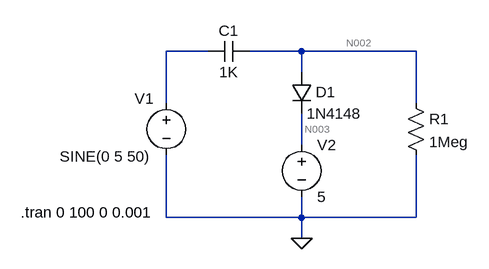
[diagram p0: schematic exercise2_transient_2.asc]
exercise2_transient_2.asc, the LTspice schematic file:
Version 4
SHEET 1 880 680
WIRE 160 -16 96 -16
WIRE 304 -16 224 -16
WIRE 480 -16 304 -16
WIRE 304 16 304 -16
WIRE 96 64 96 -16
WIRE 480 64 480 -16
WIRE 304 128 304 80
WIRE 96 240 96 144
WIRE 304 240 304 208
WIRE 304 240 96 240
WIRE 480 240 480 144
WIRE 480 240 304 240
WIRE 304 272 304 240
FLAG 304 272 0
SYMBOL diode 288 16 R0
WINDOW 0 38 31 Left 2
SYMATTR InstName D1
SYMATTR Value 1N4148
SYMBOL cap 224 -32 R90
WINDOW 0 0 32 VBottom 2
WINDOW 3 32 32 VTop 2
SYMATTR InstName C1
SYMATTR Value 1K
SYMBOL voltage 96 48 R0
WINDOW 0 -49 9 Left 2
WINDOW 3 -164 98 Left 2
WINDOW 123 0 0 Left 0
WINDOW 39 0 0 Left 0
SYMATTR InstName V1
SYMATTR Value SINE(0 5 50)
SYMBOL res 464 48 R0
SYMATTR InstName R1
SYMATTR Value 1Meg
SYMBOL voltage 304 112 R0
WINDOW 123 0 0 Left 0
WINDOW 39 0 0 Left 0
SYMATTR InstName V2
SYMATTR Value 5
TEXT -128 232 Left 2 !.tran 0 100 0 0.001

The netlist it stands for:
* exercise2_transient_2.asc
D1 N002 N003 1N4148
C1 N002 N001 1K
V1 N001 0 SINE(0 5 50)
R1 N002 0 1Meg
V2 N003 0 5
.model D D
.lib standard.dio
.tran 0 100 0 0.001
.backanno
.end

* Results of the author's LTspice run, read from the files saved beside the schematic
* Operating Point, zero values left out:
*   V(n002) = 2.522 mV
*   V(n003) = 5 V
*   I(C1) = 2.522 pA
*   I(D1) = -2.525 nA
*   I(R1) = 2.522 nA
*   I(V2) = -2.525 nA
*   I(V1) = 2.522 pA